# Altium schematic sheet vraimenthorspcb.SchDoc
size A
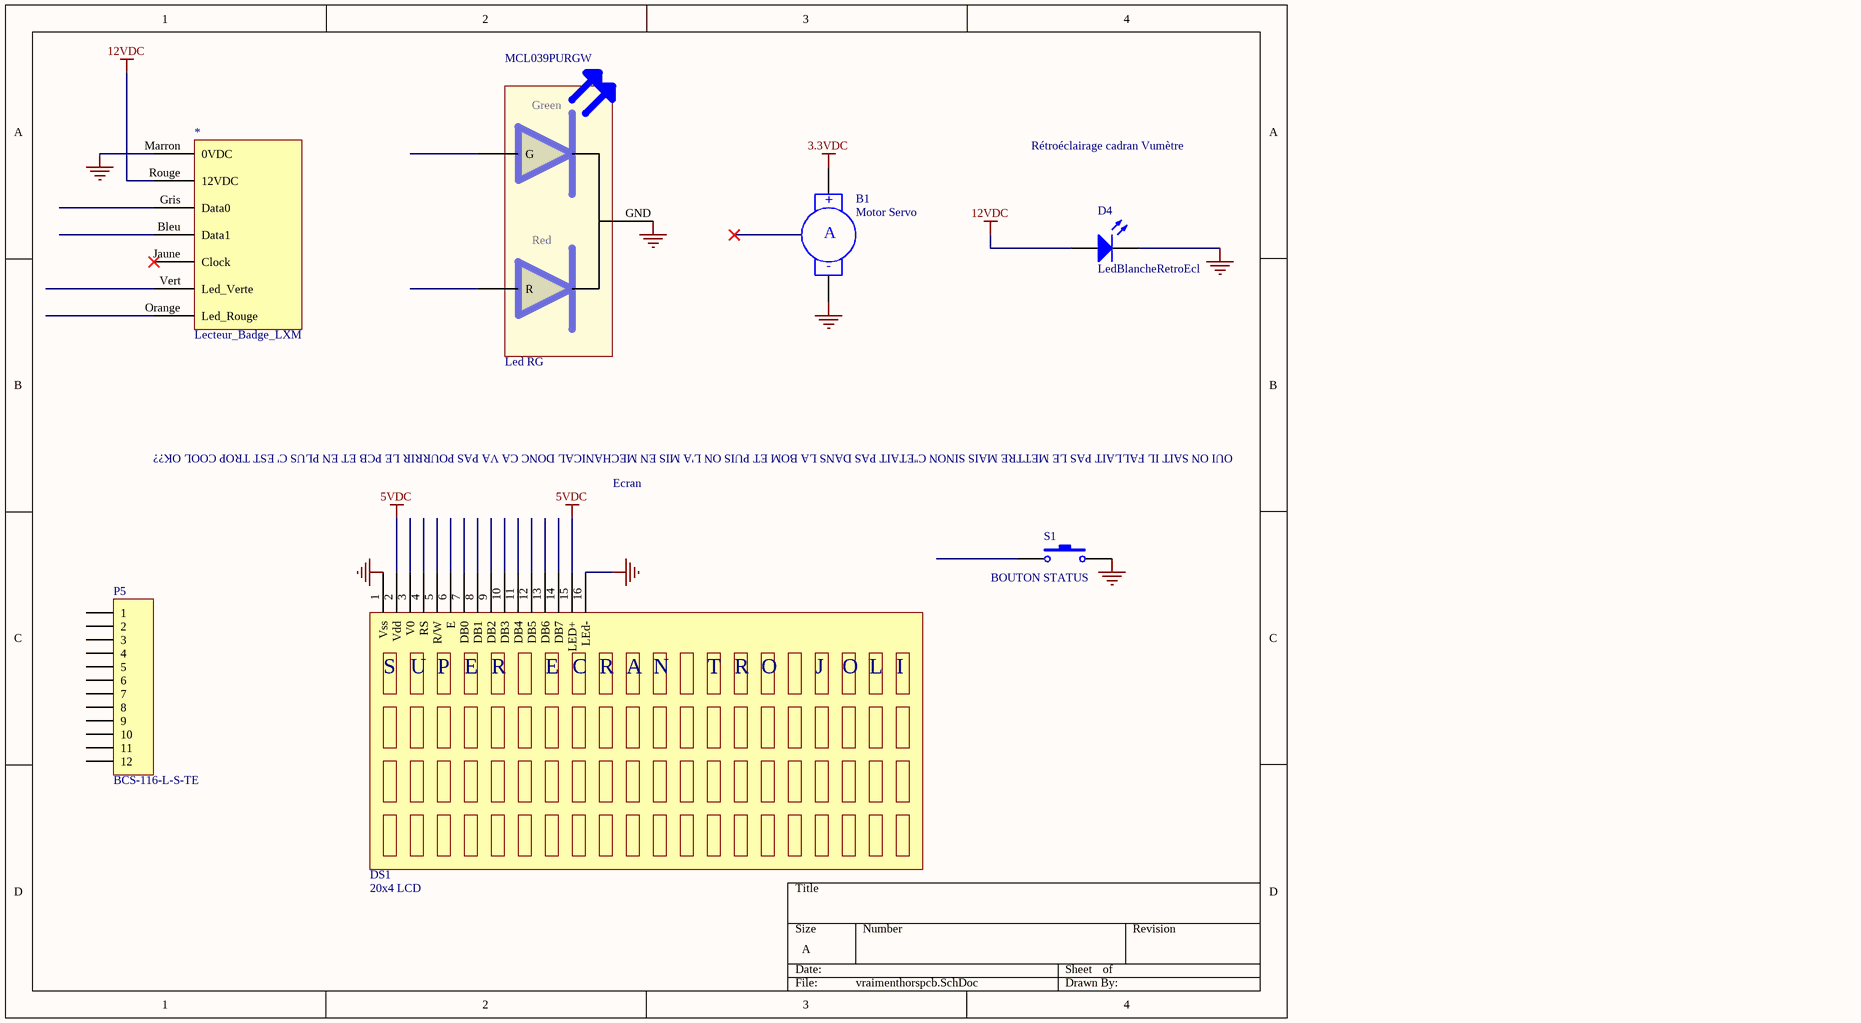
[diagram p0: vraimenthorspcb.SchDoc]

## Parts
*  Lecteur_Badge_LXM  (mechanical)
B1  Motor Servo  [RAD-0.4]  (mechanical)
D4  LedBlancheRetroEcl  [LED-0]  (mechanical)
DS1  20x4 LCD  (mechanical)
MCL039PURGW  Led RG  (mechanical)
P5  BCS-116-L-S-TE  [HDR1X12]  (mechanical)
S1  Bouton Status  [SPST-2]  (value not drawn)

## Nets
3.3VDC: B1.1(+)
5VDC: DS1.2(Vdd) DS1.15(LED+)
12VDC: *.Rouge(12VDC) D4.1(A)
GND: *.Marron(0VDC) B1.2(-) D4.2(K) DS1.1(Vss) DS1.16(LEd-) MCL039PURGW.GND S1.2

Not connected (* = marked no-connect by the designer): * Bleu(Data1) Gris(Data0) Jaune(Clock)* Orange(Led_Rouge) Vert(Led_Verte); DS1 3(V0) 4(RS) 5(R/W) 6(E) 7(DB0) 8(DB1) 9(DB2) 10(DB3) 11(DB4) 12(DB5) 13(DB6) 14(DB7); MCL039PURGW G R; P5 1 2 3 4 5 6 7 8 9 10 11 12; S1 1

## Notes on the sheet
- Rétroéclairage cadran Vumètre
- Ecran
- OUI ON SAIT IL FALLAIT PAS LE METTRE MAIS SINON C''ETAIT PAS DANS LA BOM ET PUIS ON L'A MIS EN MECHANICAL DONC CA VA PAS POURRIR LE PCB ET EN PLUS C' EST TROP COOL OK??
- (near S1) BOUTON STATUS
- (in symbol MC42008A6W-FPTLW) S; U; P; R; C; A; N; T; O; J; L; I
- (in symbol MCL039PURGW) Green; Red
- (in symbol Motor Servo) A

## Library data of the parts
* = Lecteur_Badge_LXM: Fournisseur: Gregoire; Fabricant: Stid-Security; Ref.Fournisseur: :); Ref.Fabricant: LXM_WIEGAND44b
B1 = Motor Servo: Servo Motor; Fournisseur: Olimex; Ref.Fournisseur: MS-R-1.3-9; Fabricant: Olimex; Ref.Fabricant: MS-R-1.3-9
D4 = LED0: LED Blanche retro vumetre; Fournisseur: BARBIE; Fabricant: N/A; Ref.Fabricant: N/A; Ref.Fournisseur: N/A
DS1 = MC42008A6W-FPTLW: Fournisseur: Farnell; Ref.Fournisseur: 2606880; Fabricant: Midas; Ref.Fabricant: MC42008A6W-FPTLW
MCL039PURGW = MCL039PURGW: Fournisseur: Farnell; Fabricant: Multicomp; Ref.Fournisseur: 1581194; Ref.Fabricant: MCL039PURGW
P5 = Header 12: Header, 12-Pin; Fournisseur: Farnell; Ref.Fournisseur: 1667483; Fabricant: Samtec; Ref.Fabricant: BCS-116-L-S-TE
S1 = SW-PB: Switch; Fournisseur: Farnell; Fabricant: RAFI; Ref.Fabricant: 1.10.001.001/0205; Ref.Fournisseur: 9927360